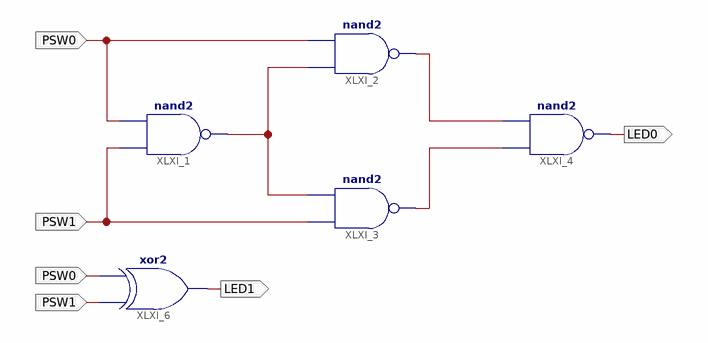
[diagram p0: schematic sheet 1]
// Xilinx ISE schematic lab4_xor.sch (spartan3) as structural Verilog: 5 symbols, 4 ports
module lab4_xor (
  input  PSW1,
  input  PSW0,
  output LED0,
  output LED1
);

  wire XLXN_1, XLXN_2, XLXN_3;

  nand XLXI_1 (XLXN_1, PSW1, PSW0);
  nand XLXI_2 (XLXN_2, XLXN_1, PSW0);
  nand XLXI_3 (XLXN_3, PSW1, XLXN_1);
  nand XLXI_4 (LED0, XLXN_3, XLXN_2);
  xor XLXI_6 (LED1, PSW1, PSW0);
endmodule
